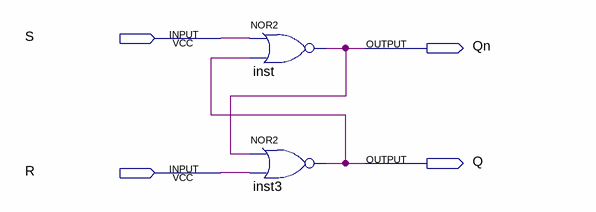
[diagram p0: schematic sheet]
// Quartus schematic LatchNOR.bdf as structural Verilog: 2 symbols, 4 pins
module LatchNOR (
  input  S,
  input  R,
  output Qn,
  output Q
);

  nor inst (Qn, S, Q);
  nor inst3 (Q, Qn, R);
endmodule
